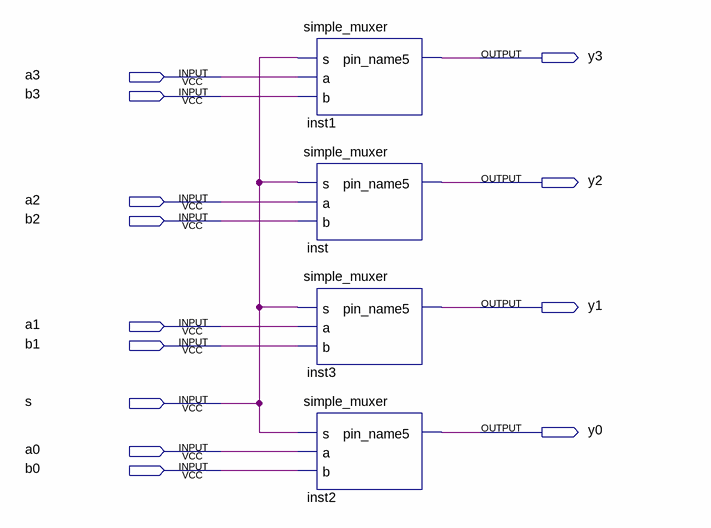
[diagram p0: schematic sheet]
// Quartus schematic muxer_2u1x4.bdf as structural Verilog: 4 symbols, 13 pins
module muxer_2u1x4 (
  input  a3,
  input  b3,
  input  a2,
  input  b2,
  input  a1,
  input  b1,
  input  s,
  input  a0,
  input  b0,
  output y3,
  output y2,
  output y1,
  output y0
);

  simple_muxer inst1 (.s(s), .a(a3), .b(b3), .pin_name5(y3));
  simple_muxer inst (.s(s), .a(a2), .b(b2), .pin_name5(y2));
  simple_muxer inst3 (.s(s), .a(a1), .b(b1), .pin_name5(y1));
  simple_muxer inst2 (.s(s), .a(a0), .b(b0), .pin_name5(y0));
endmodule
